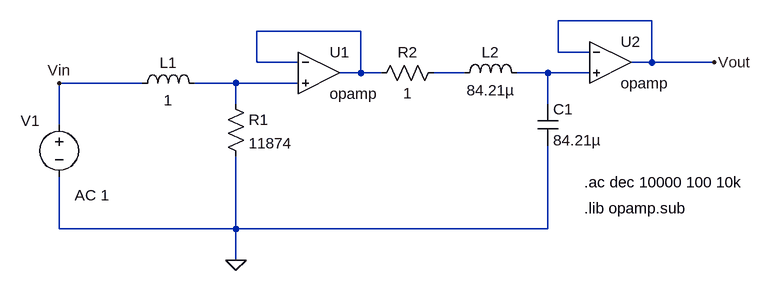
[diagram p0: schematic 6_circuitoBW.asc]
6_circuitoBW.asc, the LTspice schematic file:
Version 4
SHEET 1 932 680
WIRE 608 112 464 112
WIRE 160 128 0 128
WIRE 464 160 464 112
WIRE 512 160 464 160
WIRE 0 176 0 128
WIRE 64 176 0 176
WIRE 608 176 608 112
WIRE 608 176 576 176
WIRE 704 176 608 176
WIRE 160 192 160 128
WIRE 160 192 128 192
WIRE 192 192 160 192
WIRE 320 192 272 192
WIRE 448 192 400 192
WIRE 512 192 448 192
WIRE -176 208 -304 208
WIRE -32 208 -96 208
WIRE 64 208 -32 208
WIRE -32 240 -32 208
WIRE 448 240 448 192
WIRE -304 272 -304 208
WIRE -304 432 -304 352
WIRE -32 432 -32 320
WIRE -32 432 -304 432
WIRE 448 432 448 304
WIRE 448 432 -32 432
WIRE -32 480 -32 432
FLAG -304 208 Vin
FLAG 704 176 Vout
FLAG -32 480 0
SYMBOL voltage -304 256 R0
WINDOW 123 24 124 Left 2
WINDOW 39 0 0 Left 0
WINDOW 0 -59 10 Left 2
SYMATTR Value2 AC 1
SYMATTR InstName V1
SYMATTR Value ""
SYMBOL ind -192 224 R270
WINDOW 0 32 56 VTop 2
WINDOW 3 5 56 VBottom 2
SYMATTR InstName L1
SYMATTR Value 1
SYMBOL res -48 224 R0
SYMATTR InstName R1
SYMATTR Value 11874
SYMBOL OpAmps\\opamp 96 128 R0
SYMATTR InstName U1
SYMBOL res 288 176 R90
WINDOW 0 0 56 VBottom 2
WINDOW 3 32 56 VTop 2
SYMATTR InstName R2
SYMATTR Value 1
SYMBOL ind 304 208 R270
WINDOW 0 32 56 VTop 2
WINDOW 3 5 56 VBottom 2
SYMATTR InstName L2
SYMATTR Value 84.21µ
SYMBOL cap 432 240 R0
SYMATTR InstName C1
SYMATTR Value 84.21µ
SYMBOL OpAmps\\opamp 544 112 R0
SYMATTR InstName U2
TEXT 504 400 Left 2 !.lib opamp.sub
TEXT 504 360 Left 2 !.ac dec 10000 100 10k

The netlist it stands for:
* 6_circuitoBW.asc
V1 Vin 0 AC 1
L1 Vin N004 1
R1 N004 0 11874
XU1 N001 N004 N001 opamp Aol=100K GBW=10Meg  ; pins invin noninvin out
R2 N002 N001 1
L2 N002 N003 84.21µ
C1 N003 0 84.21µ
XU2 Vout N003 Vout opamp Aol=100K GBW=10Meg  ; pins invin noninvin out
.lib opamp.sub
.ac dec 10000 100 10k
.backanno
.end